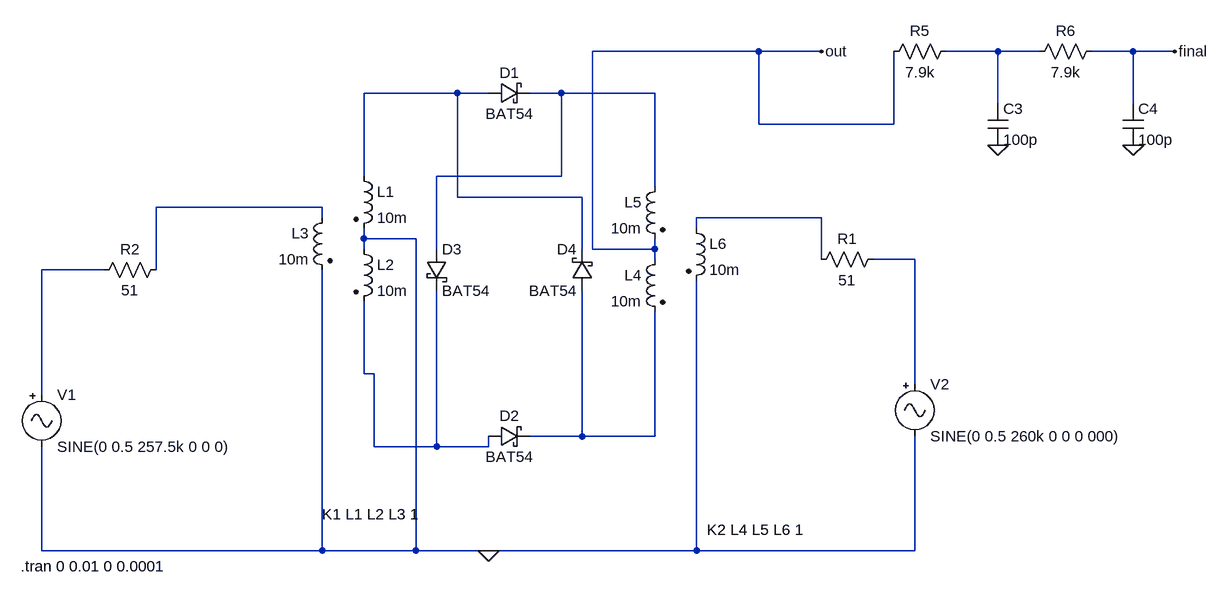
[diagram p0: schematic draftOfMixer.asc]
draftOfMixer.asc, the LTspice schematic file:
Version 4
SHEET 1 2196 680
WIRE 672 -128 416 -128
WIRE 768 -128 672 -128
WIRE 1040 -128 960 -128
WIRE 1104 -128 1040 -128
WIRE 1248 -128 1184 -128
WIRE 1312 -128 1248 -128
WIRE 208 -64 64 -64
WIRE 256 -64 208 -64
WIRE 368 -64 320 -64
WIRE 512 -64 368 -64
WIRE 1040 -48 1040 -128
WIRE 1248 -48 1248 -128
WIRE 672 -16 672 -128
WIRE 880 -16 880 -128
WIRE 880 -16 672 -16
WIRE 64 64 64 -64
WIRE 368 64 368 -64
WIRE 368 64 176 64
WIRE 512 80 512 -64
WIRE 208 96 208 -64
WIRE 400 96 208 96
WIRE 0 112 -256 112
WIRE 0 128 0 112
WIRE 768 128 576 128
WIRE 576 144 576 128
WIRE 64 160 64 144
WIRE 144 160 64 160
WIRE 64 176 64 160
WIRE 176 176 176 64
WIRE 400 176 400 96
WIRE 416 176 416 -128
WIRE 512 176 512 160
WIRE 512 176 416 176
WIRE 512 192 512 176
WIRE 768 192 768 128
WIRE 912 192 848 192
WIRE -336 208 -432 208
WIRE -256 208 -256 112
WIRE 64 368 64 256
WIRE 80 368 64 368
WIRE 912 384 912 192
WIRE -432 400 -432 208
WIRE 400 464 400 240
WIRE 400 464 320 464
WIRE 512 464 512 272
WIRE 512 464 400 464
WIRE 80 480 80 368
WIRE 176 480 176 240
WIRE 176 480 80 480
WIRE 256 480 256 464
WIRE 256 480 176 480
WIRE -432 640 -432 480
WIRE 0 640 0 208
WIRE 0 640 -432 640
WIRE 144 640 144 160
WIRE 144 640 0 640
WIRE 256 640 144 640
WIRE 576 640 576 224
WIRE 576 640 256 640
WIRE 912 640 912 464
WIRE 912 640 576 640
FLAG 768 -128 out
FLAG 256 640 0
FLAG 1040 16 0
FLAG 1248 16 0
FLAG 1312 -128 final
SYMBOL Misc\\signal -432 384 R0
WINDOW 123 0 0 Left 0
WINDOW 39 0 0 Left 0
SYMATTR InstName V1
SYMATTR Value SINE(0 0.5 257.5k 0 0 0)
SYMBOL Misc\\signal 912 368 R0
WINDOW 123 0 0 Left 0
WINDOW 39 0 0 Left 0
SYMATTR InstName V2
SYMATTR Value SINE(0 0.5 260k 0 0 0 000)
SYMBOL res 864 176 R90
WINDOW 0 0 56 VBottom 2
WINDOW 3 32 56 VTop 2
SYMATTR InstName R1
SYMATTR Value 51
SYMBOL res -240 192 R90
WINDOW 0 0 56 VBottom 2
WINDOW 3 32 56 VTop 2
SYMATTR InstName R2
SYMATTR Value 51
SYMBOL schottky 256 -48 R270
WINDOW 0 32 32 VTop 2
WINDOW 3 0 32 VBottom 2
SYMATTR InstName D1
SYMATTR Value BAT54
SYMATTR Description Diode
SYMATTR Type diode
SYMBOL schottky 256 480 R270
WINDOW 0 32 32 VTop 2
WINDOW 3 0 32 VBottom 2
SYMATTR InstName D2
SYMATTR Value BAT54
SYMATTR Description Diode
SYMATTR Type diode
SYMBOL schottky 160 176 R0
SYMATTR InstName D3
SYMATTR Value BAT54
SYMATTR Description Diode
SYMATTR Type diode
SYMBOL schottky 416 240 R180
WINDOW 0 24 64 Left 2
WINDOW 3 24 0 Left 2
SYMATTR InstName D4
SYMATTR Value BAT54
SYMATTR Description Diode
SYMATTR Type diode
SYMBOL ind2 48 48 R0
SYMATTR InstName L1
SYMATTR Value 10m
SYMATTR Type ind
SYMBOL ind2 48 160 R0
SYMATTR InstName L2
SYMATTR Value 10m
SYMATTR Type ind
SYMBOL ind2 16 112 M0
SYMATTR InstName L3
SYMATTR Value 10m
SYMATTR Type ind
SYMBOL ind2 528 176 M0
SYMATTR InstName L4
SYMATTR Value 10m
SYMATTR Type ind
SYMBOL ind2 528 64 M0
SYMATTR InstName L5
SYMATTR Value 10m
SYMATTR Type ind
SYMBOL ind2 560 128 R0
SYMATTR InstName L6
SYMATTR Value 10m
SYMATTR Type ind
SYMBOL cap 1024 -48 R0
SYMATTR InstName C3
SYMATTR Value 100p
SYMBOL cap 1232 -48 R0
SYMATTR InstName C4
SYMATTR Value 100p
SYMBOL res 976 -144 R90
WINDOW 0 0 56 VBottom 2
WINDOW 3 32 56 VTop 2
SYMATTR InstName R5
SYMATTR Value 7.9k
SYMBOL res 1200 -144 R90
WINDOW 0 0 56 VBottom 2
WINDOW 3 32 56 VTop 2
SYMATTR InstName R6
SYMATTR Value 7.9k
TEXT -464 664 Left 2 !.tran 0 0.01 0 0.0001
TEXT 0 584 Left 2 !K1 L1 L2 L3 1
TEXT 592 608 Left 2 !K2 L4 L5 L6 1

The netlist it stands for:
* draftOfMixer.asc
V1 N007 0 SINE(0 0.5 257.5k 0 0 0)
V2 N006 0 SINE(0 0.5 260k 0 0 0 000)
R1 N006 N005 51
R2 N004 N007 51
D1 N002 N003 BAT54
D2 N008 N009 BAT54
D3 N003 N008 BAT54
D4 N009 N002 BAT54
L1 N002 0 10m
L2 0 N008 10m
L3 N004 0 10m
L4 out N009 10m
L5 N003 out 10m
L6 N005 0 10m
C3 N001 0 100p
C4 final 0 100p
R5 N001 out 7.9k
R6 final N001 7.9k
.model D D
.lib standard.dio
.tran 0 0.01 0 0.0001
K1 L1 L2 L3 1
K2 L4 L5 L6 1
.backanno
.end